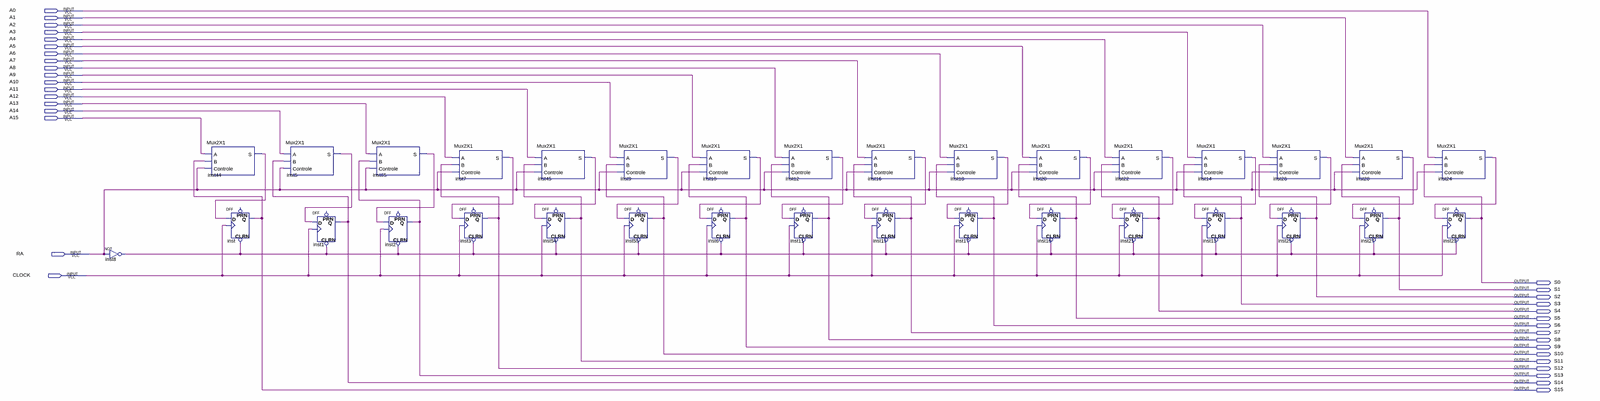
[diagram p0: schematic sheet, whole]
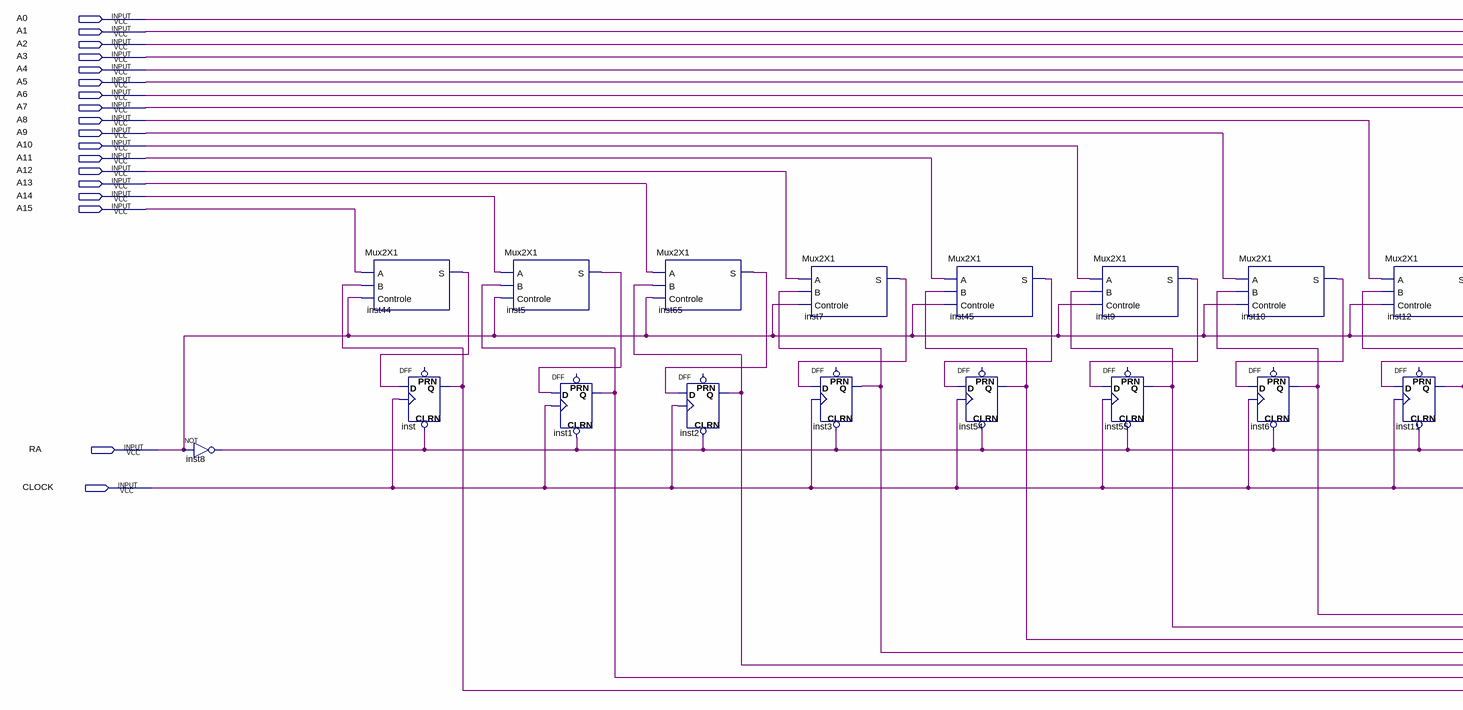
[diagram p1: schematic sheet, left part]
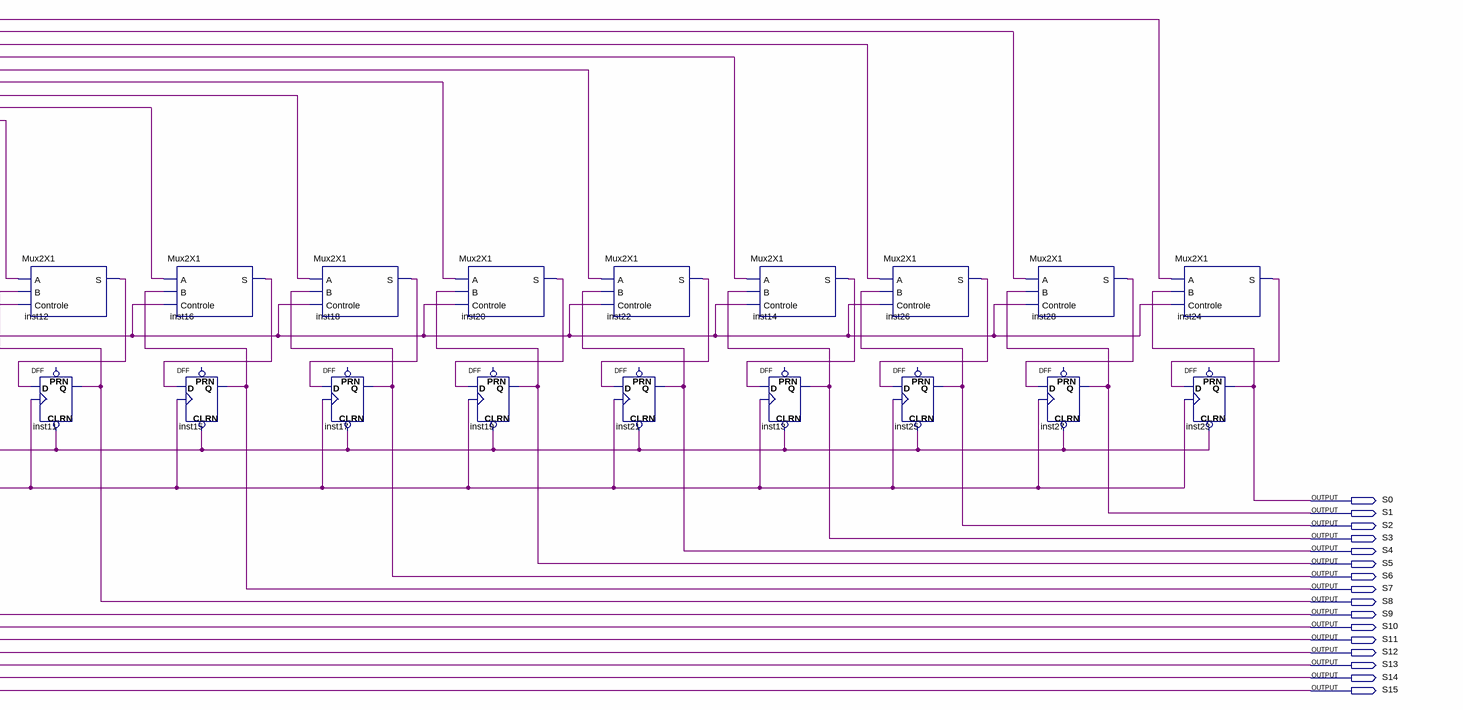
[diagram p2: schematic sheet, right part]
// Quartus schematic Multiplicador.bdf as structural Verilog: 33 symbols, 34 pins
module Multiplicador (
  input  A0,
  input  A1,
  input  A2,
  input  A3,
  input  A4,
  input  A5,
  input  A6,
  input  A7,
  input  A8,
  input  A9,
  input  A10,
  input  A11,
  input  A12,
  input  A13,
  input  A14,
  input  A15,
  input  RA,
  input  CLOCK,
  output S0,
  output S1,
  output S2,
  output S3,
  output S4,
  output S5,
  output S6,
  output S7,
  output S8,
  output S9,
  output S10,
  output S11,
  output S12,
  output S13,
  output S14,
  output S15
);

  wire inst5_s, inst7_s, inst8_out, inst9_s, inst10_s, inst12_s, inst14_s, inst16_s, inst18_s, inst20_s,
       inst22_s, inst24_s, inst26_s, inst28_s, inst44_s, inst45_s, inst65_s;

  not inst8 (inst8_out, RA);
  Mux2X1 inst44 (.A(A15), .B(S15), .Controle(RA), .S(inst44_s));
  DFF inst (.CLRN(inst8_out), .CLK(CLOCK), .D(inst44_s), .Q(S15));  // open: PRN
  Mux2X1 inst5 (.A(A14), .B(S14), .Controle(RA), .S(inst5_s));
  DFF inst1 (.CLRN(inst8_out), .CLK(CLOCK), .D(inst5_s), .Q(S14));  // open: PRN
  Mux2X1 inst65 (.A(A13), .B(S13), .Controle(RA), .S(inst65_s));
  DFF inst2 (.CLRN(inst8_out), .CLK(CLOCK), .D(inst65_s), .Q(S13));  // open: PRN
  Mux2X1 inst7 (.A(A12), .B(S12), .Controle(RA), .S(inst7_s));
  DFF inst3 (.CLRN(inst8_out), .CLK(CLOCK), .D(inst7_s), .Q(S12));  // open: PRN
  Mux2X1 inst45 (.A(A11), .B(S11), .Controle(RA), .S(inst45_s));
  DFF inst54 (.CLRN(inst8_out), .CLK(CLOCK), .D(inst45_s), .Q(S11));  // open: PRN
  Mux2X1 inst9 (.A(A10), .B(S10), .Controle(RA), .S(inst9_s));
  DFF inst55 (.CLRN(inst8_out), .CLK(CLOCK), .D(inst9_s), .Q(S10));  // open: PRN
  Mux2X1 inst10 (.A(A9), .B(S9), .Controle(RA), .S(inst10_s));
  DFF inst6 (.CLRN(inst8_out), .CLK(CLOCK), .D(inst10_s), .Q(S9));  // open: PRN
  Mux2X1 inst12 (.A(A8), .B(S8), .Controle(RA), .S(inst12_s));
  DFF inst11 (.CLRN(inst8_out), .CLK(CLOCK), .D(inst12_s), .Q(S8));  // open: PRN
  Mux2X1 inst16 (.A(A7), .B(S7), .Controle(RA), .S(inst16_s));
  DFF inst15 (.CLRN(inst8_out), .CLK(CLOCK), .D(inst16_s), .Q(S7));  // open: PRN
  Mux2X1 inst18 (.A(A6), .B(S6), .Controle(RA), .S(inst18_s));
  DFF inst17 (.CLRN(inst8_out), .CLK(CLOCK), .D(inst18_s), .Q(S6));  // open: PRN
  Mux2X1 inst20 (.A(A5), .B(S5), .Controle(RA), .S(inst20_s));
  DFF inst19 (.CLRN(inst8_out), .CLK(CLOCK), .D(inst20_s), .Q(S5));  // open: PRN
  Mux2X1 inst22 (.A(A4), .B(S4), .Controle(RA), .S(inst22_s));
  DFF inst21 (.CLRN(inst8_out), .CLK(CLOCK), .D(inst22_s), .Q(S4));  // open: PRN
  Mux2X1 inst14 (.A(A3), .B(S3), .Controle(RA), .S(inst14_s));
  DFF inst13 (.CLRN(inst8_out), .CLK(CLOCK), .D(inst14_s), .Q(S3));  // open: PRN
  Mux2X1 inst26 (.A(A2), .B(S2), .Controle(RA), .S(inst26_s));
  DFF inst25 (.CLRN(inst8_out), .CLK(CLOCK), .D(inst26_s), .Q(S2));  // open: PRN
  Mux2X1 inst28 (.A(A1), .B(S1), .Controle(RA), .S(inst28_s));
  DFF inst27 (.CLRN(inst8_out), .CLK(CLOCK), .D(inst28_s), .Q(S1));  // open: PRN
  Mux2X1 inst24 (.A(A0), .B(S0), .Controle(RA), .S(inst24_s));
  DFF inst23 (.CLRN(inst8_out), .CLK(CLOCK), .D(inst24_s), .Q(S0));  // open: PRN
endmodule
